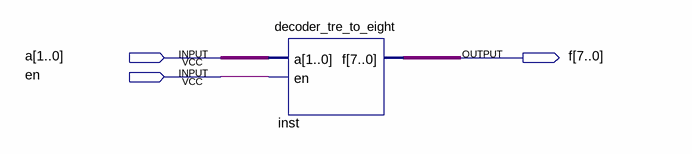
[diagram p0: schematic sheet]
// Quartus schematic Block_decoder_tre_to_eight.bdf as structural Verilog: 1 symbols, 3 pins
module Block_decoder_tre_to_eight (
  input  [1:0] a,
  input  en,
  output [7:0] f
);

  decoder_tre_to_eight inst (.a(a), .en(en), .f(f));
endmodule
